# Altium schematic sheet MIRA220CSP-Sheet1.SchDoc: MIRA220 CSP
size A3; Date: 28-June-2022; CheckedBy: -not-used-; Author: -not-used-; CompanyName: AMS; DrawnBy: -not-used-; Engineer: MKOC; Organization: AMs; Address1: Borsbeeksebrug 36; Address2: 2600 Antwerpen; Address3: Belgium; Address4: T: +32 3 260 1730 | F: +32 3 260 1779; Revision: 2.2; SheetNumber: 1; SheetTotal: 1; PageSetup: Record=PageOptions|CenterHorizontal=True|CenterVertical=True|PrintScale=0.71|XCorrection=1.00|YCorrection=1.00|PrintKind=0|BorderSize=5000000|LeftOffset=0|BottomOffset=0|Orientation=2|PaperLength=1000|PaperWidth=1000|Scale=100|PaperSource=7|PrintQuality=-4|MediaType=1|DitherType=10|PrintScaleMode=1|PaperKind=A4|PaperIndex=9; Comment1: Reference Design; Comment2: (for Raspberry PI); Project: MIRA220; ProjectName: -not-used-; Rule: PcbType=ProtelPcb
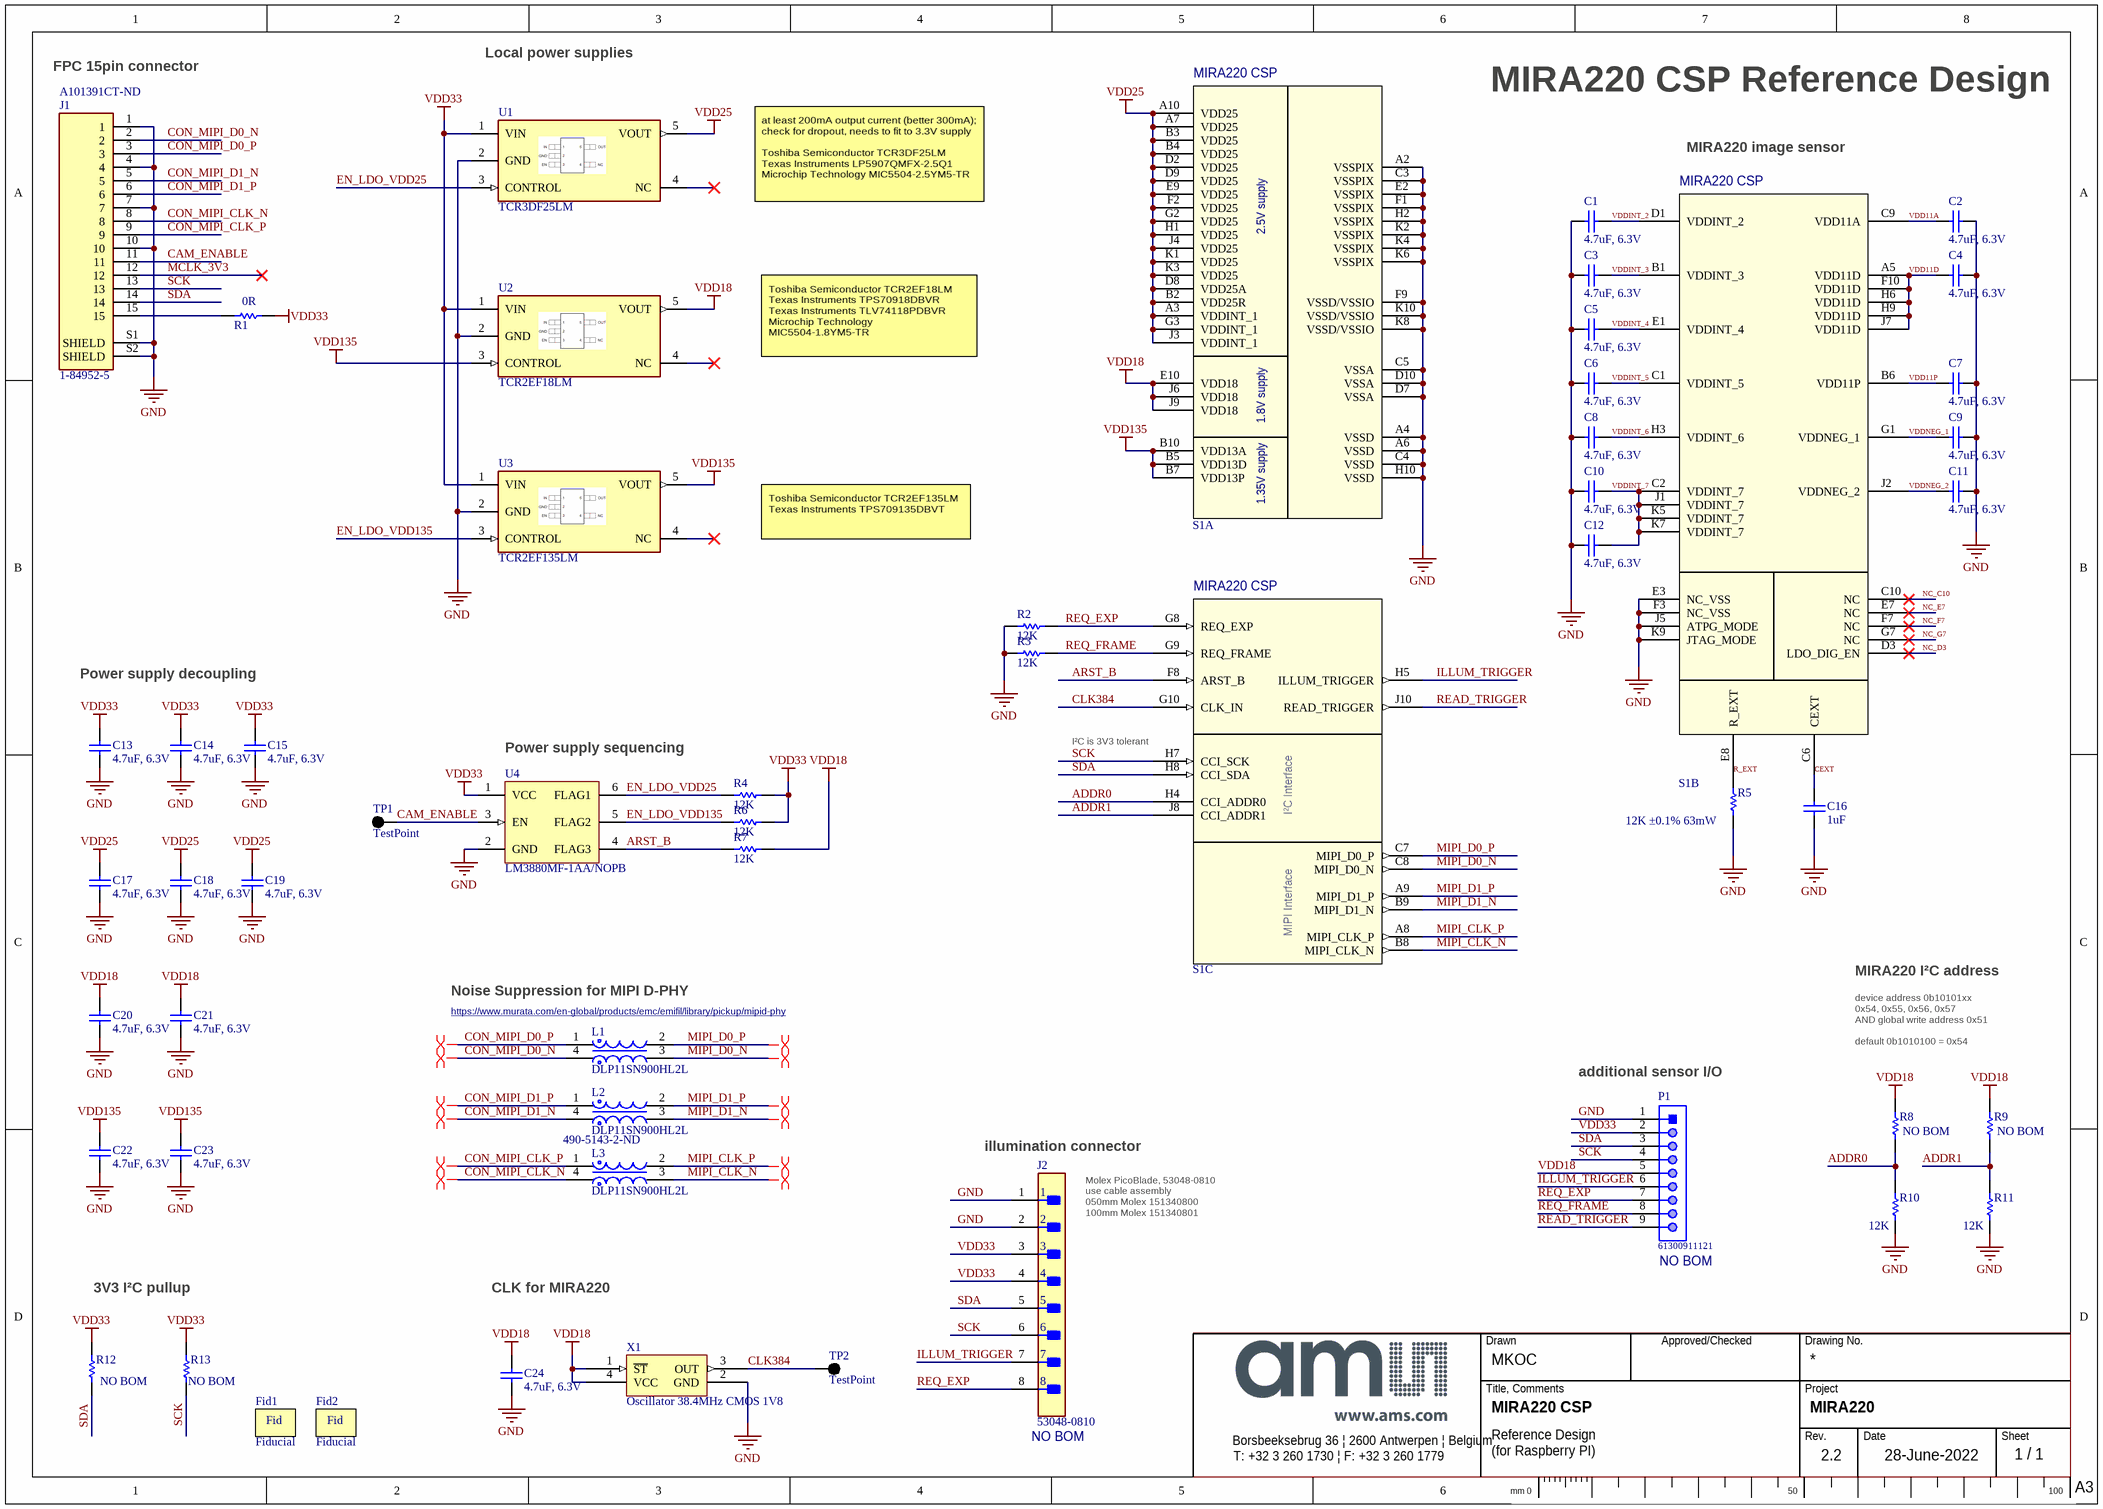
[diagram p0: MIRA220CSP-Sheet1.SchDoc]

## Parts
C1  4.7uF, 6.3V  [CAPC0402_N]
C2  4.7uF, 6.3V  [CAPC0402_N]
C3  4.7uF, 6.3V  [CAPC0402_N]
C4  4.7uF, 6.3V  [CAPC0402_N]
C5  4.7uF, 6.3V  [CAPC0402_N]
C6  4.7uF, 6.3V  [CAPC0402_N]
C7  4.7uF, 6.3V  [CAPC0402_N]
C8  4.7uF, 6.3V  [CAPC0402_N]
C9  4.7uF, 6.3V  [CAPC0402_N]
C10  4.7uF, 6.3V  [CAPC0402_N]
C11  4.7uF, 6.3V  [CAPC0402_N]
C12  4.7uF, 6.3V  [CAPC0402_N]
C13  4.7uF, 6.3V  [CAPC0402_N]
C14  4.7uF, 6.3V  [CAPC0402_N]
C15  4.7uF, 6.3V  [CAPC0402_N]
C16  1uF  [CAPC0402_N]
C17  4.7uF, 6.3V  [CAPC0402_N]
C18  4.7uF, 6.3V  [CAPC0402_N]
C19  4.7uF, 6.3V  [CAPC0402_N]
C20  4.7uF, 6.3V  [CAPC0402_N]
C21  4.7uF, 6.3V  [CAPC0402_N]
C22  4.7uF, 6.3V  [CAPC0402_N]
C23  4.7uF, 6.3V  [CAPC0402_N]
C24  4.7uF, 6.3V  [CAPC0402_N]
Fid1  Fiducial  [Fiducial]  (no BOM)
Fid2  Fiducial  [Fiducial]  (no BOM)
J1  1-84952-5  Supplier Part Number 1: A101391CT-ND  [TE_1-84952-5]
J2  53048-0810  [FP-53048-0810-MFG]  (no BOM)
L1  DLP11SN900HL2L  [FP-DLP11S-MFG]
L2  DLP11SN900HL2L  [FP-DLP11S-MFG]
L3  DLP11SN900HL2L  Supplier Part Number 1: 490-5143-2-ND  [FP-DLP11S-MFG]
P1  61300911121  [61300911121]  (no BOM)
R1  0R  [RESC0805_N]
R2  12K  [RESC0402_N]
R3  12K  [RESC0402_N]
R4  12K  [RESC0402_N]
R5  12K ±0.1% 63mW  [RESC0402_N]
R6  12K  [RESC0402_N]
R7  12K  [RESC0402_N]
R8  NO BOM  [RESC0402_N]  (no BOM)
R9  NO BOM  [RESC0402_N]  (no BOM)
R10  12K  [RESC0402_N]
R11  12K  [RESC0402_N]
R12  NO BOM  [RESC0402_N]  (no BOM)
R13  NO BOM  [RESC0402_N]  (no BOM)
S1  MIRA CSP  [MIRA220CSP]  (value not drawn)  (parts A,B,C of 3)
TP1  TestPoint  [TP_075mm]  (no BOM)
TP2  TestPoint  [TP_075mm]  (no BOM)
U1  TCR3DF25LM  [FP-DBV0005A-IPC_B]
U2  TCR2EF18LM  [FP-DBV0005A-IPC_B]
U3  TCR2EF135LM  [FP-DBV0005A-IPC_B]
U4  LM3880MF-1AA/NOPB  [DBV0006A_N]
X1  Oscillator 38.4MHz CMOS 1V8  [2.5x2_OSC]

## Nets
GND: C1.1 C2.2 C3.1 C4.2 C5.1 C6.1 C7.2 C8.1 C9.2 C10.1 C11.2 C12.1 C13.1 C14.1 C15.1 C16.1 C17.1 C18.1 C19.1 C20.1 C21.1 C22.1 C23.1 C24.1 J1.1 J1.4 J1.7 J1.10 J1.S1(SHIELD) J1.S2(SHIELD) J2.1 J2.2 P1.1 R2.2 R3.2 R5.1 R10.1 R11.1 S1.A2(VSSPIX) S1.A4(VSSD) S1.A6(VSSD) S1.C3(VSSPIX) S1.C4(VSSD) S1.C5(VSSA) S1.D7(VSSA) S1.D10(VSSA) S1.E2(VSSPIX) S1.E3(NC_VSS) S1.F1(VSSPIX) S1.F3(NC_VSS) S1.F9(VSSD/VSSIO) S1.H2(VSSPIX) S1.H10(VSSD) S1.J5(ATPG_MODE) S1.K2(VSSPIX) S1.K4(VSSPIX) S1.K6(VSSPIX) S1.K8(VSSD/VSSIO) S1.K9(JTAG_MODE) S1.K10(VSSD/VSSIO) U1.2(GND) U2.2(GND) U3.2(GND) U4.2(GND) X1.2(GND)
VDD18: C20.2 C21.2 C24.2 P1.5 R7.1 R8.2 R9.2 S1.E10(VDD18) S1.J6(VDD18) S1.J9(VDD18) U2.5(VOUT) X1.1(~{ST}) X1.4(VCC)
VDD25: C17.2 C18.2 C19.2 S1.A3(VDDINT_1) S1.A7(VDD25) S1.A10(VDD25) S1.B2(VDD25R) S1.B3(VDD25) S1.B4(VDD25) S1.D2(VDD25) S1.D8(VDD25A) S1.D9(VDD25) S1.E9(VDD25) S1.F2(VDD25) S1.G2(VDD25) S1.G3(VDDINT_1) S1.H1(VDD25) S1.J3(VDDINT_1) S1.J4(VDD25) S1.K1(VDD25) S1.K3(VDD25) U1.5(VOUT)
VDD33: C13.2 C14.2 C15.2 J2.3 J2.4 P1.2 R1.2 R4.1 R6.1 R12.2 R13.2 U1.1(VIN) U2.1(VIN) U3.1(VIN) U4.1(VCC)
VDD135: C22.2 C23.2 S1.B5(VDD13D) S1.B7(VDD13P) S1.B10(VDD13A) U2.3(CONTROL) U3.5(VOUT)
ADDR0: R8.1 R10.2 S1.H4(CCI_ADDR0)
ADDR1: R9.1 R11.2 S1.J8(CCI_ADDR1)
ARST_B: R7.2 S1.F8(ARST_B) U4.4(FLAG3)
CAM_ENABLE: J1.11 TP1.1 U4.3(EN)
CEXT: C16.2 S1.C6(CEXT)
CLK384: S1.G10(CLK_IN) TP2.1 X1.3(OUT)
CON_MIPI_CLK_N: J1.8 L3.4
CON_MIPI_CLK_P: J1.9 L3.1
CON_MIPI_D0_N: J1.2 L1.4
CON_MIPI_D0_P: J1.3 L1.1
CON_MIPI_D1_N: J1.5 L2.4
CON_MIPI_D1_P: J1.6 L2.1
EN_LDO_VDD25: R4.2 U1.3(CONTROL) U4.6(FLAG1)
EN_LDO_VDD135: R6.2 U3.3(CONTROL) U4.5(FLAG2)
ILLUM_TRIGGER: J2.7 P1.6 S1.H5(ILLUM_TRIGGER)
MCLK_3V3: J1.12
MIPI_CLK_N: L3.3 S1.B8(MIPI_CLK_N)
MIPI_CLK_P: L3.2 S1.A8(MIPI_CLK_P)
MIPI_D0_N: L1.3 S1.C8(MIPI_D0_N)
MIPI_D0_P: L1.2 S1.C7(MIPI_D0_P)
MIPI_D1_N: L2.3 S1.B9(MIPI_D1_N)
MIPI_D1_P: L2.2 S1.A9(MIPI_D1_P)
NC_C10: S1.C10(NC)
NC_D3: S1.D3(LDO_DIG_EN)
NC_E7: S1.E7(NC)
NC_F7: S1.F7(NC)
NC_G7: S1.G7(NC)
R_EXT: R5.2 S1.E8(R_EXT)
READ_TRIGGER: P1.9 S1.J10(READ_TRIGGER)
REQ_EXP: J2.8 P1.7 R2.1 S1.G8(REQ_EXP)
REQ_FRAME: P1.8 R3.1 S1.G9(REQ_FRAME)
SCK: J1.13 J2.6 P1.4 R13.1 S1.H7(CCI_SCK)
SDA: J1.14 J2.5 P1.3 R12.1 S1.H8(CCI_SDA)
VDD11A: C2.1 S1.C9(VDD11A)
VDD11D: C4.1 S1.A5(VDD11D) S1.F10(VDD11D) S1.H6(VDD11D) S1.H9(VDD11D) S1.J7(VDD11D)
VDD11P: C7.1 S1.B6(VDD11P)
VDDINT_2: C1.2 S1.D1(VDDINT_2)
VDDINT_3: C3.2 S1.B1(VDDINT_3)
VDDINT_4: C5.2 S1.E1(VDDINT_4)
VDDINT_5: C6.2 S1.C1(VDDINT_5)
VDDINT_6: C8.2 S1.H3(VDDINT_6)
VDDINT_7: C10.2 C12.2 S1.C2(VDDINT_7) S1.J1(VDDINT_7) S1.K5(VDDINT_7) S1.K7(VDDINT_7)
VDDNEG_1: C9.1 S1.G1(VDDNEG_1)
VDDNEG_2: C11.1 S1.J2(VDDNEG_2)
NetJ1_15: J1.15 R1.1

Not connected (* = marked no-connect by the designer): U1 4(NC)*; U2 4(NC)*; U3 4(NC)*

## Layout directives
differential pair: CON_MIPI_CLK_N, CON_MIPI_CLK_P, CON_MIPI_D0_N, CON_MIPI_D0_P, CON_MIPI_D1_N, CON_MIPI_D1_P, MIPI_CLK_N, MIPI_CLK_P, MIPI_D0_N, MIPI_D0_P, MIPI_D1_N, MIPI_D1_P

## Notes on the sheet
- Local power supplies
- (near J1) FPC 15pin connector
- MIRA220 CSP Reference Design
- MIRA220 image sensor
- at least 200mA output current (better 300mA); check for dropout, needs to fit to 3.3V supply
  Toshiba Semiconductor TCR3DF25LM
  Texas Instruments LP5907QMFX-2.5Q1
  Microchip Technology MIC5504-2.5YM5-TR
- Toshiba Semiconductor TCR2EF18LM
  Texas Instruments TPS70918DBVR
  Texas Instruments TLV74118PDBVR
  Microchip Technology MIC5504-1.8YM5-TR
- Toshiba Semiconductor TCR2EF135LM
  Texas Instruments TPS709135DBVT
- Power supply decoupling
- (near U4) Power supply sequencing
- (near S1) I²C is 3V3 tolerant
- (near L1) Noise Suppression for MIPI D-PHY
- MIRA220 I²C address
- (near L1) https://www.murata.com/en-global/products/emc/emifil/library/pickup/mipid-phy
- device address 0b10101xx
  0x54, 0x55, 0x56, 0x57
  AND global write address 0x51
  default 0b1010100 = 0x54
- (near P1) additional sensor I/O
- (near J2) illumination connector
- (near J2) Molex PicoBlade, 53048-0810
  use cable assembly
  050mm Molex 151340800
  100mm Molex 151340801
- (near P1) NO BOM
- 3V3 I²C pullup
- CLK for MIRA220
- (near J2) NO BOM
- Title, Comments
- Drawn
- Approved/Checked
- Drawing No.
- Project
- Borsbeeksebrug 36 | 2600 Antwerpen | Belgium
- T: +32 3 260 1730 | F: +32 3 260 1779
- Rev.
- Date
- Sheet
- mm 0
- 50
- 100
- A3
- (in symbol Fiducial) Fid
- (in symbol MIRA_CSP, part A) MIRA220 CSP; 2.5V supply; 1.8V supply; 1.35V supply
- (in symbol MIRA_CSP, part B) MIRA220 CSP
- (in symbol MIRA_CSP, part C) MIRA220 CSP; I²C Interface; MIPI Interface

## Library data of the parts
C1-C11 C13-C15 C17-C24 = Open[[/\]]Open: GRM155R60J475ME47D Capacitor 4.7uF, 6.3V, X5R, 0402, ±10% Tolerance,; Manufacturer: Murata; Case-EIA: 0402; Rated Voltage: 6.3; Value: 4.7u; Designator: C?; Tolerance: ±10%; Dielectric: X5R; Technology: SMT; Part Number: GRM155R60J475ME47D; Componenttype: Capacitor; Footprint: 0402
  C11: Supplier 1: Digi-Key; Supplier Part Number 1: 490-5915-1-ND
C12 = Open[[/\]]Open: GRM155R60J475ME47D Capacitor 4.7uF, 6.3V, X5R, 0402, ±10% Tolerance,; Manufacturer: Open; Case-EIA: 0402; Rated Voltage: 16 V; Dielectric: X7R; Designator: C?; Component: Open_±10%_0402__Open; Tolerance: ±10%; Value: GRM155R60J475ME47D; Technology: SMT; Part Number: GRM155R60J475ME47D; Componenttype: Capacitor; Temperaturerating: X7R; Footprint: 0402
C16 = Open[[/\]]Open: GRM155R70J105KA12J, Capacitor  0402, ±10% Tolerance, 10V, 1uF; Manufacturer: Murata; Case-EIA: 0402; Value: 1.0u; Designator: C?; Part Number: GRM155R70J105KA12J; Componenttype: Capacitor; Footprint: 0402; Supplier 1: Digi-Key; Supplier Part Number 1: 490-13339-2-ND
Fid1 Fid2 = Fiducial: Alignment feature for PCB Assembly; Part Number: NA; Designator: Fid?; Component: Fiducial; Componenttype: Fiducial
J1 = 1-84952-5: Conn FPC Connector SKT 15 POS 1mm Solder RA SMD T/R; MF: TE Connectivity; Package: None; Availability: Unavailable; SnapEDA_Link: https://www.snapeda.com/parts/1-84952-5/TE%20Connectivity%20AMP%20Connectors/view-part/817662/?ref=snap; DigiKey-Purchase-URL: https://snapeda.com/shop?store=DigiKey&id=817662; MP: 1-84952-5; Value: *; Price: None; Mouser-Purchase-URL: https://snapeda.com/shop?store=Mouser&id=817662; EU_RoHS_Compliance: Compliant; Supplier 1: Digi-Key
J2 = CMP-04776-000035-1: CONN HEADER R/A 8POS 1.25MM; Manufacturer: Molex; Voltage Rating: 125V; Current Rating: 1A; Conn Gender: Male; Number Of Contacts: 8; Conn Orientation: Right Angle; Temperature Range Low: -40°C; Octopart: https://octopart.com/53048-0810-molex-276821; Contact Material: Tin; Footprint Url: https://www.molex.com/pdm_docs/sd/530480810_sd.pdf; ComponentLink2Description: Datasheet; Manufacturer Part Number: 53048-0810; Temperature Range High: +85°C; Height: 3.7mm; Package: 53048-0810; RoHS: TRUE; Lead Free: Yes; Number Of Rows: 1; Automotive: No; Digikey Description: CONN HEADER R/A 8POS 1.25MM; Temperature: -40°C to +85°C; Device Class L3: unset; Category: Conn; Mouser Description: Headers & Wire Housings RIGHT ANGLE HDR 8P; Device Class L1: Connectors; Pitch: 1.25mm; ComponentLink2URL: https://upverter.com/datasheet/dfdcdbc1139de5bf0e8fc2847cd2afe73073fd55.pdf; Device Class L2: Headers and Wire Housings
L1-L3 = CMP-2000-06161-2: Common Mode Choke, 0504, 90Ω @ 100MHz, 1.88Ω, 20%, 150mA; Number of Lines: 2; DC Resistance (DCR): 1.5R; Impedance: 90R; Shielding: Shielded; Voltage Rating: 5V; Mount: Surface Mount; Case Code (Imperial): 0504; Min Operating Temperature: -40°C; Current: 150mA; Width: 0.039inch; Depth: 1mm; Radiation Hardening: No; DC Current: 150mA; Max Operating Temperature: 85°C; Tolerance: 20%; Max DC Current: 150mA; Test Frequency: 100MHz; Case Code (Metric): 1210; Lead Free: Lead Free; Length: 1.25mm; Military Standard: Not; Termination: SMD/SMT; Current Rating: 150mA; REACH SVHC: No SVHC; Packaging: Tape and Reel; Case/Package: 0504; Package Quantity: 1; Height: 0.82mm; Part Number: DLP11SN900HL2L
  L3: Supplier 1: Digi-Key
P1 = CMP-1502-01080-1: THT Vertical Pin Header WR-PHD, Pitch 2.54 mm, Single Row, 9 pins; Manufacturer: Wurth Elektronik; Pitch: 2.54mm; Gender: Male; Working Voltage: 250VAC; Contact Resistance: 20mOhm; Withstanding Voltage: 500VAC; Pin Number: 9; Rated Current: 3A; Package Reference: 61300911121; Part Number: 61300911121; Mounting Technology: THT; Publisher: WurthElektronik; Manufacturer URL: http://www.we-online.de; Orientation: Vertical; Datasheet URL: https://katalog.we-online.de/em/datasheet/6130xx11121.pdf; Operating Temperature: -40to105degC; Row Number: Single; Packaging: Bag
R1 = MCWR08X0000FTL: Resistor 0R 0805; Manufacturer: Multicomp; Component: 0R_±1%_0805_125mW_MCWR08X0000FTL; Designator: R?; Tolerance: ±1%; Powerrating: 125mW; Componenttype: Resistor; Value: 0R; Part Number: MCWR08X0000FTL; Supplier Part Number 1: 2747563; Supplier 1: Farnell; Footprint: 0805
R2-R11 = ERA2AEB123X[[/\]]PANASONIC: Resistor 12K 0402, ±0.1% Tolerance, 63mW max Pd, 50V; Component: 12K_±0.1%_0402_63mW_ERA2AEB123X; Tolerance: ±0.1%; Value: 12K; Part Number: ERA2AEB123X; Componenttype: Resistor; Manufacturer: PANASONIC; Powerrating: 63mW; Voltagerating: 50V; Supplier Part Number 1: P12KDCCT-ND; Supplier 1: Digi-key; Footprint: 0402
R12 R13 = ERA2AEB123X[[/\]]PANASONIC: Resistor 2K 0402, ±0.1% Tolerance, 63mW max Pd, 50V; Value: 12K; Component: 12K_±0.1%_0402_63mW_ERA2AEB123X; Tolerance: ±0.1%; Part Number: ERA2AEB123X; Componenttype: Resistor; Manufacturer: PANASONIC; Powerrating: 63mW; Voltagerating: 50V; Supplier Part Number 1: P12KDCCT-ND; Supplier 1: Digi-key; Footprint: 0402
S1 = MIRA_CSP: Mira220-2QM1WA; Part Number: Mira220-2QM1WA; Parameter 1: *
TP1 TP2 = 5001: Test Point, various footprints
U1-U3 = LDO-STO23-5: IC REG LINEAR fixed Voltage, SOT23-5 / SOT-25 / SC74A package; Mount: Surface Mount
U4 = CMP-0063-01015-4: Power Sequencer, 6-pin SOT-23, Pb-Free, 1000 Reel; Manufacturer: Texas Instruments; High-Reliability: Y; PackageTopMarking: F20A*XTT; CompType: MiscPower; PowerWise: N; ComponentLink1URL: http://www.ti.com/general/docs/lit/getliterature.tsp?genericPartNumber=LM3880&fileType=pdf; PackageReference: DBV0006A; PartNumber: LM3880MF-1AA/NOPB; Code_JEDEC: MO-178-AB; PackageDescription: Molded SOT-23, .115 x .063 x .040in Body, 6 Lead, .0375in in Pitch; Code_IPC: SOT26A-6; ComponentLink1Description: Datasheet URL; PinCount: 6; RoHS: Y
X1 = SG-211SEE38.4000MT3: Manufacturer: Epson; Designator: X?; Tolerance: ±15ppm; Component: SG-211SEE38.4000MT3; Componenttype: Oscillator; Value: 38.4MHz; Part Number: SG-211SEE38.4000MT3; Supplier Part Number 1: SER3703CT-ND; Supplier 1: Digi-Key